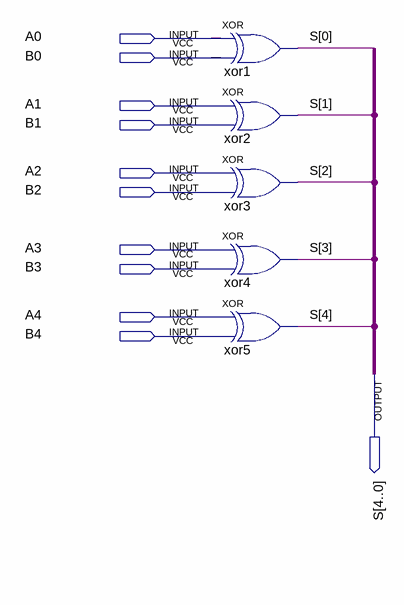
[diagram p0: schematic sheet]
// Quartus schematic circuito_completo_xor.bdf as structural Verilog: 5 symbols, 11 pins
module circuito_completo_xor (
  input  A0,
  input  B0,
  input  A1,
  input  B1,
  input  A2,
  input  B2,
  input  A3,
  input  B3,
  input  A4,
  input  B4,
  output [4:0] S
);

  xor xor1 (S[0], A0, B0);
  xor xor2 (S[1], A1, B1);
  xor xor3 (S[2], A2, B2);
  xor xor4 (S[3], A3, B3);
  xor xor5 (S[4], A4, B4);
endmodule
